# Altium schematic sheet 09_FPGA_misc.SchDoc: FPGA misc
size A3; Organization: Lime Microsystems; Address1: Surrey Tech Centre; Address2: Guildford GU2 7YG; Address3: Surrey; Address4: United Kingdom; Revision: SoDeRa-PCI v1.0; SheetNumber: 9; SheetTotal: 15
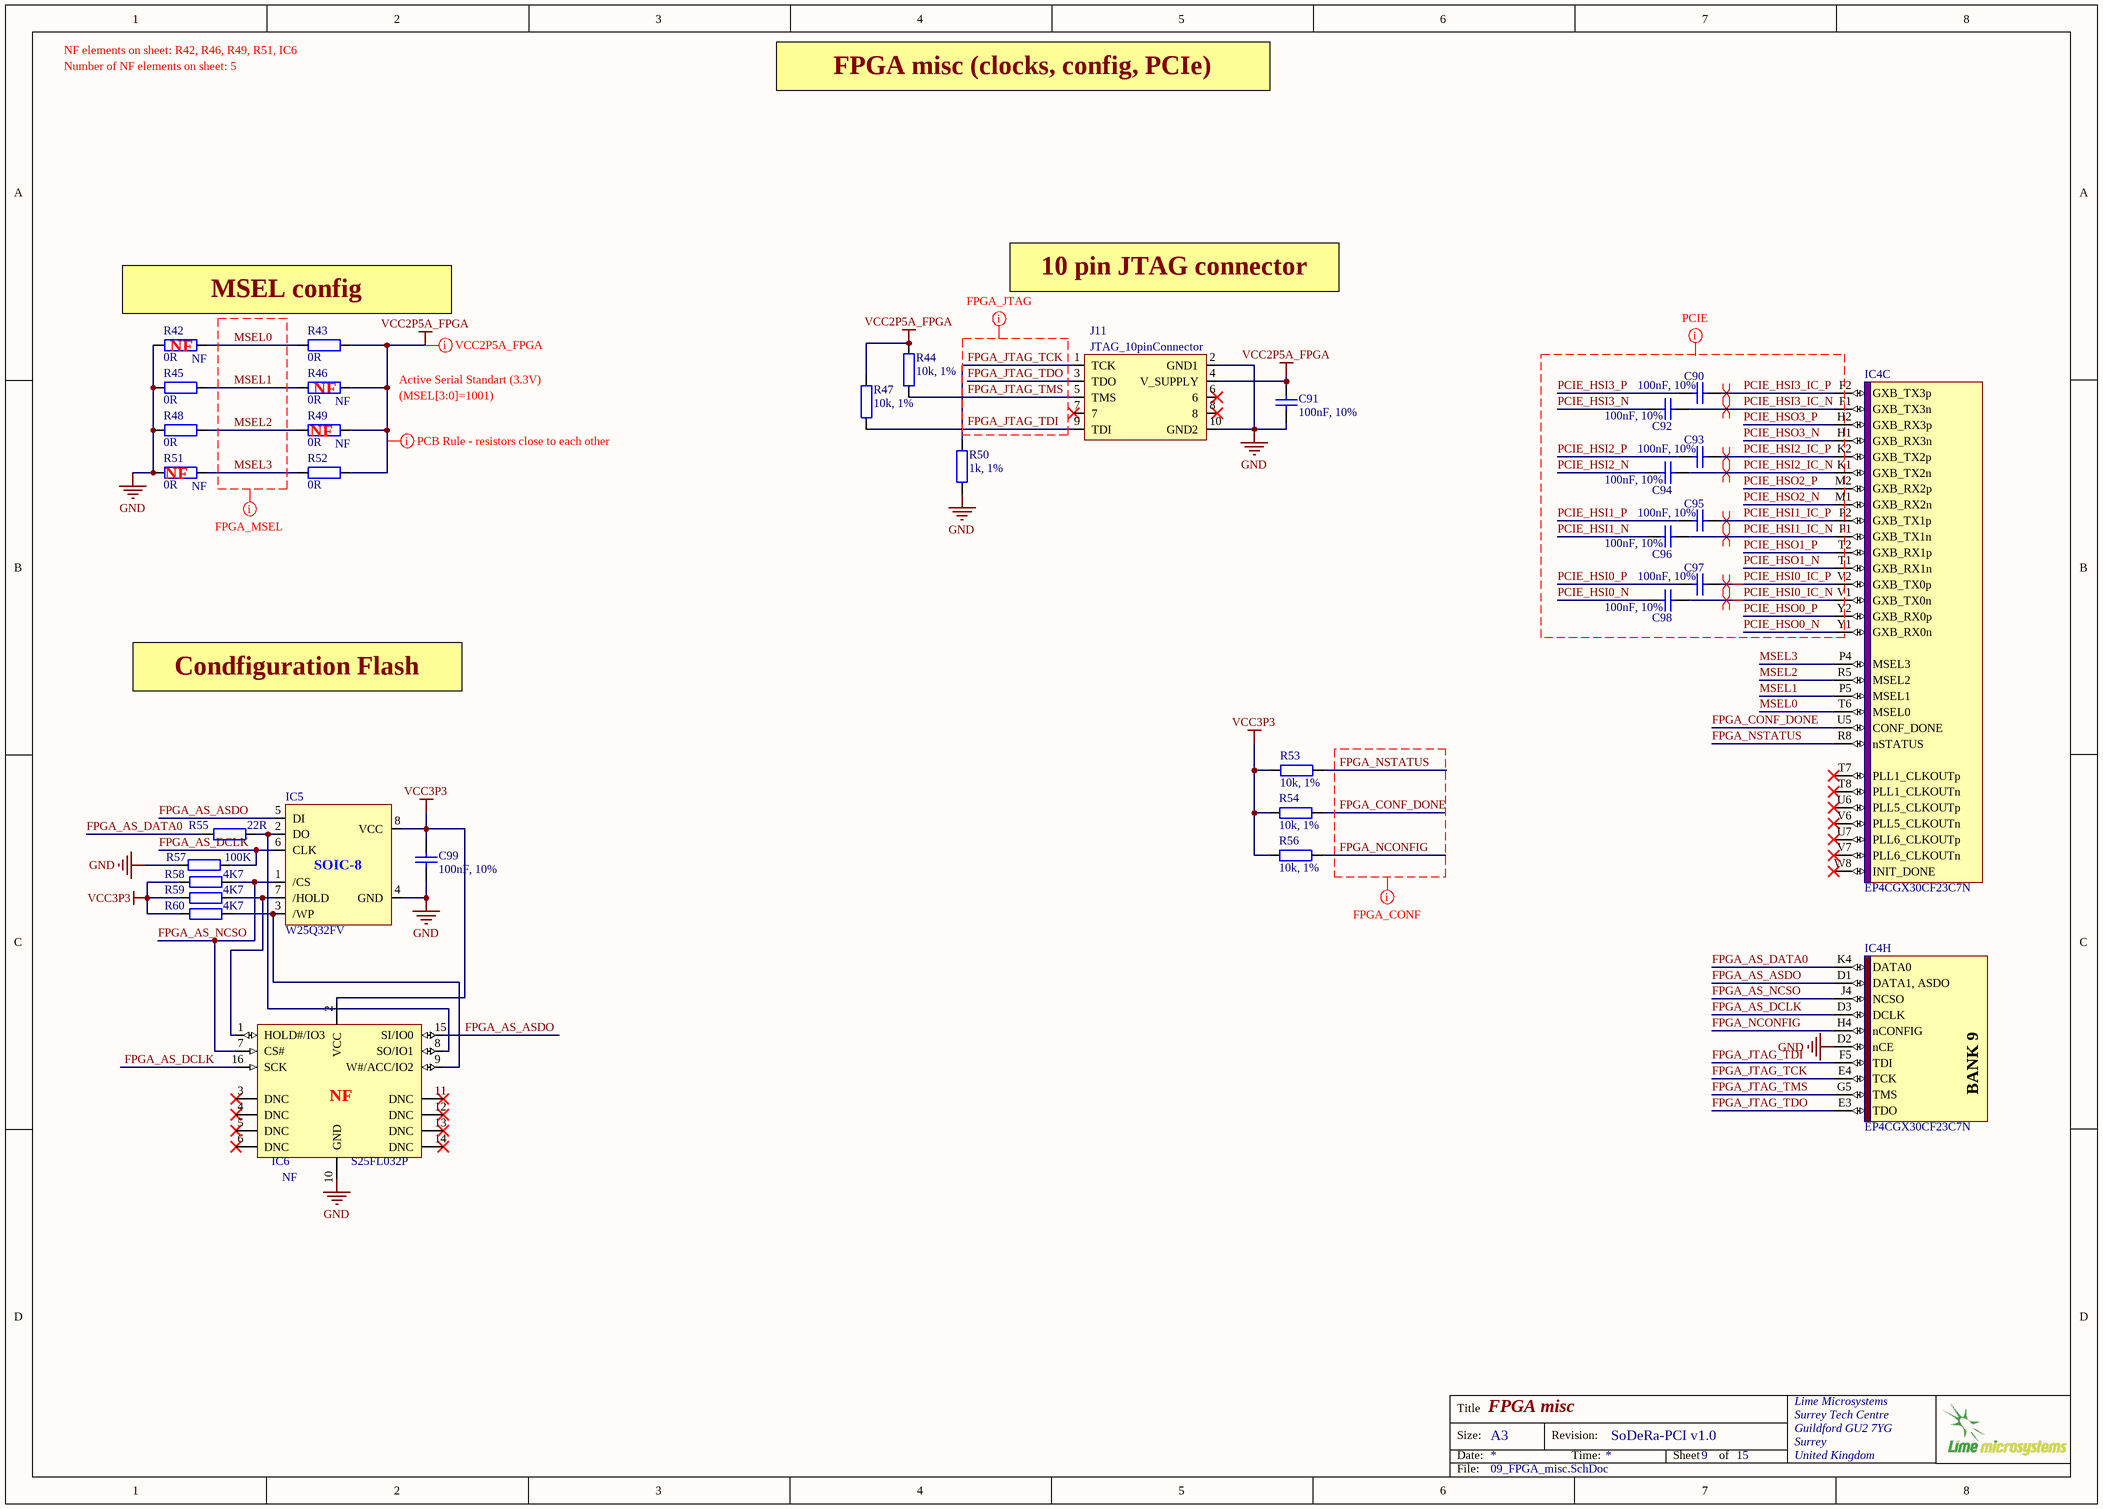
[diagram p0: 09_FPGA_misc.SchDoc]

## Parts
C90  100nF, 10%  [CAP0402]
C91  100nF, 10%  [CAP0402]
C92  100nF, 10%  [CAP0402]
C93  100nF, 10%  [CAP0402]
C94  100nF, 10%  [CAP0402]
C95  100nF, 10%  [CAP0402]
C96  100nF, 10%  [CAP0402]
C97  100nF, 10%  [CAP0402]
C98  100nF, 10%  [CAP0402]
C99  100nF, 10%  [CAP0402]
IC4  EP4CGX30CF23C7N  [ALTR-FBGA484_A-200]  (parts C,H of 10)
IC5  W25Q32FV  [SOIC127P600-8DL_v3]
IC6  S25FL032P  Assembly Info: NF  [SOIC16_WIDE]
J11  JTAG_10pinConnector  [HEADER5x2_SM]
R42  0R  Assembly Info: NF  [RES0402]
R43  0R  [RES0402]
R44  10k, 1%  [RES0402]
R45  0R  [RES0402]
R46  0R  Assembly Info: NF  [RES0402]
R47  10k, 1%  [RES0402]
R48  0R  [RES0402]
R49  0R  Assembly Info: NF  [RES0402]
R50  1k, 1%  [RES0402]
R51  0R  Assembly Info: NF  [RES0402]
R52  0R  [RES0402]
R53  10k, 1%  [RES0402]
R54  10k, 1%  [RES0402]
R55  22R  [RES0402]
R56  10k, 1%  [RES0402]
R57  100K  [RES0402]
R58  4K7  [RES0402]
R59  4K7  [RES0402]
R60  4K7  [RES0402]

## Nets
GND: C91.2 C99.2 IC4.D2(nCE) IC5.4(GND) IC6.10(GND) J11.2(GND1) J11.10(GND2) R42.2 R45.2 R48.2 R50.2 R51.2 R57.2
VCC2P5A_FPGA: C91.1 J11.4(V_SUPPLY) R43.1 R44.1 R46.1 R47.1 R49.1 R52.1
VCC3P3: C99.1 IC5.8(VCC) IC6.2(VCC) R53.1 R54.1 R56.1 R58.1 R59.1 R60.1
FPGA_AS_ASDO: IC4.D1(DATA1,_ASDO) IC5.5(DI) IC6.15(SI/IO0)
FPGA_AS_DATA0: IC4.K4(DATA0) R55.2
FPGA_AS_DCLK: IC4.D3(DCLK) IC5.6(CLK) IC6.16(SCK) R57.1
FPGA_AS_NCSO: IC4.J4(NCSO) IC5.1(/CS) IC6.7(CS#) R58.2
FPGA_CONF_DONE: IC4.U5(CONF_DONE) R54.2
FPGA_JTAG_TCK: IC4.E4(TCK) J11.1(TCK) R50.1
FPGA_JTAG_TDI: IC4.F5(TDI) J11.9(TDI) R47.2
FPGA_JTAG_TDO: IC4.E3(TDO) J11.3(TDO)
FPGA_JTAG_TMS: IC4.G5(TMS) J11.5(TMS) R44.2
FPGA_NCONFIG: IC4.H4(nCONFIG) R56.2
FPGA_NSTATUS: IC4.R8(nSTATUS) R53.2
MSEL0: IC4.T6(MSEL0) R42.1 R43.2
MSEL1: IC4.P5(MSEL1) R45.1 R46.2
MSEL2: IC4.R5(MSEL2) R48.1 R49.2
MSEL3: IC4.P4(MSEL3) R51.1 R52.2
PCIE_HSI0_IC_N: C98.1 IC4.V1(GXB_TX0n)
PCIE_HSI0_IC_P: C97.1 IC4.V2(GXB_TX0p)
PCIE_HSI0_N: C98.2
PCIE_HSI0_P: C97.2
PCIE_HSI1_IC_N: C96.1 IC4.P1(GXB_TX1n)
PCIE_HSI1_IC_P: C95.1 IC4.P2(GXB_TX1p)
PCIE_HSI1_N: C96.2
PCIE_HSI1_P: C95.2
PCIE_HSI2_IC_N: C94.1 IC4.K1(GXB_TX2n)
PCIE_HSI2_IC_P: C93.1 IC4.K2(GXB_TX2p)
PCIE_HSI2_N: C94.2
PCIE_HSI2_P: C93.2
PCIE_HSI3_IC_N: C92.1 IC4.F1(GXB_TX3n)
PCIE_HSI3_IC_P: C90.1 IC4.F2(GXB_TX3p)
PCIE_HSI3_N: C92.2
PCIE_HSI3_P: C90.2
PCIE_HSO0_N: IC4.Y1(GXB_RX0n)
PCIE_HSO0_P: IC4.Y2(GXB_RX0p)
PCIE_HSO1_N: IC4.T1(GXB_RX1n)
PCIE_HSO1_P: IC4.T2(GXB_RX1p)
PCIE_HSO2_N: IC4.M1(GXB_RX2n)
PCIE_HSO2_P: IC4.M2(GXB_RX2p)
PCIE_HSO3_N: IC4.H1(GXB_RX3n)
PCIE_HSO3_P: IC4.H2(GXB_RX3p)
NetIC5_2: IC5.2(DO) IC6.8(SO/IO1) R55.1
NetIC5_3: IC5.3(/WP) IC6.9(W#/ACC/IO2) R60.2
NetIC5_7: IC5.7(/HOLD) IC6.1(HOLD#/IO3) R59.2

Not connected (* = marked no-connect by the designer): IC4 T7(PLL1_CLKOUTp)* T8(PLL1_CLKOUTn)* U6(PLL5_CLKOUTp)* U7(PLL6_CLKOUTp)* V6(PLL5_CLKOUTn)* V7(PLL6_CLKOUTn)* W8(INIT_DONE)*; IC6 3(DNC)* 4(DNC)* 5(DNC)* 6(DNC)* 11(DNC)* 12(DNC)* 13(DNC)* 14(DNC)*; J11 6* 7* 8*

## Layout directives
net class FPGA_JTAG: FPGA_JTAG_TCK, FPGA_JTAG_TDI, FPGA_JTAG_TDO, FPGA_JTAG_TMS
net class FPGA_CONF: FPGA_CONF_DONE, FPGA_NCONFIG, FPGA_NSTATUS
rule Undefined: VCC2P5A_FPGA
net class FPGA_MSEL: MSEL0, MSEL1, MSEL2, MSEL3
differential pair: PCIE_HSI0_IC_N, PCIE_HSI0_IC_P, PCIE_HSI1_IC_N, PCIE_HSI1_IC_P, PCIE_HSI2_IC_N, PCIE_HSI2_IC_P, PCIE_HSI3_IC_N, PCIE_HSI3_IC_P
net class PCIE: PCIE_HSI0_IC_N, PCIE_HSI0_IC_P, PCIE_HSI0_N, PCIE_HSI0_P, PCIE_HSI1_IC_N, PCIE_HSI1_IC_P, PCIE_HSI1_N, PCIE_HSI1_P, PCIE_HSI2_IC_N, PCIE_HSI2_IC_P, PCIE_HSI2_N, PCIE_HSI2_P, PCIE_HSI3_IC_N, PCIE_HSI3_IC_P, PCIE_HSI3_N, PCIE_HSI3_P, PCIE_HSO0_N, PCIE_HSO0_P, PCIE_HSO1_N, PCIE_HSO1_P, PCIE_HSO2_N, PCIE_HSO2_P, PCIE_HSO3_N, PCIE_HSO3_P
net class VCC2P5A_FPGA: VCC2P5A_FPGA

## Notes on the sheet
- NF elements on sheet: R42, R46, R49, R51, IC6
- Number of NF elements on sheet: 5
- FPGA misc (clocks, config, PCIe)
- MSEL config
- 10 pin JTAG connector
- (near R42) NF
- Active Serial Standart (3.3V)
- (near R49) NF
- (near R46) NF
- (MSEL[3:0]=1001)
- (near R51) NF
- Condfiguration Flash
- (near IC6) NF
- Title
- Size:
- Date:
- A3
- Revision:
- Time:
- Sheet
- of
- File:
- (in symbol EP4CGX30CF23C7N, part H) BANK 9
- (in symbol W25Q32FV) SOIC-8

## Library data of the parts
C90-C98 = Cap_0603: Manufacturer: Murata; Brand: Murata Electronics; Type: General Purpose MLCC; Capacitance: 0.1 uF; Temperature Coefficient / Code: +/- 15 %; Voltage Rating DC: 16 V; Supplier 1: Mouser; Supplier Part Number 1: 81-GRM155R71C104KA88; Tolerance: 10 %; Case Code - in: 0402; Category: Multilayer Ceramic Capacitors MLCC - SMD/SMT; Value: 100nF, 10%
C99 = Cap_0603: Manufacturer: Murata; Manufacturer Part Number 1: GRM155R71C104KA88D; Brand: Murata Electronics; Type: General Purpose MLCC; Capacitance: 0.1 uF; Temperature Coefficient / Code: +/- 15 %; Voltage Rating DC: 16 V; Supplier 1: Mouser; Supplier Part Number 1: 81-GRM155R71C104KA88; Tolerance: 10 %; Case Code - in: 0402; Category: Multilayer Ceramic Capacitors MLCC - SMD/SMT; Value: 100nF, 10%; Manufacturer Part Number: GRM155R71C104KA88D
IC4 = EP4CGX30CF23C7N: Manufacturer: Altera; Voltage - Supply: 1.16 V ~ 1.24 V; Number of I/O: 290; Total RAM Bits: 1105920; Number of Logic Elements/Cells: 29440; Number of LABs/CLBs: 1840; Supplier 1: Digi-Key; Package / Case: 484-BGA; Operating Temperature: 0°C ~ 85°C; Mounting Type: Surface Mount; Number of Gates: -; Supplier Device Package: 484-FBGA (23x23); Category: Integrated Circuits (ICs); RoHS: RoHS Compliant; Supplier Part Number 1: 544-2730-ND; Manufacturer Part Number 1: EP4CGX30CF23C7N
IC5 = W25Q32FV: Manufacturer: Winbond Electronics; Manufacturer Part Number 1: W25Q32FVSSIG; Voltage - Supply: 2.7 V ~ 3.6 V; Interface: SPI Serial; Memory Type: FLASH; Speed: 104MHz; Memory Size: 32M (4M x 8); Supplier 1: Digi-Key; Package / Case: 8-SOIC (0.209", 5.30mm Width); RoHS: RoHS Compliant; Packaging: Tube; Format - Memory: FLASH; Supplier Device Package: 8-SOIC; Operating Temperature: -40°C ~ 85°C; Category: Integrated Circuits (ICs); Supplier Part Number 1: W25Q32FVSSIG-ND
IC6 = S25FL032P: Manufacturer Part Number 1: S25FL032P0XMFI001; Manufacturer: Spansion; Speed: 104MHz; Interface: SPI Serial; Memory Size: 32M (4M x 8); Format - Memory: FLASH; Memory Type: FLASH - NOR; Voltage - Supply: 2.7 V ~ 3.6 V; Package / Case: 16-SOIC (0.295", 7.50mm Width); Supplier Device Package: 16-SOIC; Operating Temperature: -40°C ~ 85°C; RoHS: RoHS Compliant; Category: Integrated Circuits (ICs); Packaging: Tube; Supplier 1: Digi-Key; Supplier Part Number 1: S25FL032P0XMFI001-ND
J11 = JTAG_connector_10pin: Manufacturer Part Number 1: 54202-G0805LF; Connector Type: Header, Unshrouded; Number of Positions: 10; Number of Positions Loaded: All; Supplier 1: Digi-Key; Supplier Part Number 1: 609-4723-ND; Contact Type: Male Pin; Category: Connectors, Interconnects; Contact Finish: Gold or Gold, GXT™; Color: Black; Number of Rows: 2; Mounting Type: Surface Mount
R42 R43 R45 R46 R48 R49 R51 R52 = Res_0402: Manufacturer: Yageo; Supplier 1: Digi-Key; Supplier Part Number 1: 311-0.0JRTR-ND; Composition: Thick Film; Package / Case: 0402 (1005 Metric); Category: Resistors; Value: 0R
R44 R47 R53 R54 R56 = Res_0402: Manufacturer: Yageo; Manufacturer Part Number 1: RC0402FR-0710KL; Temperature Coefficient: ±100ppm/°C; Power (Watts): 0.063W, 1/16W; Value: 10k, 1%; Supplier 1: Digi-Key; Supplier Part Number 1: 311-10.0KLRTR-ND; Resistance (Ohms): 10k; Packaging: Tape & Reel (TR); RoHS: RoHS Compliant; Package / Case: 0402 (1005 Metric); Tolerance: ±1%; Operating Temperature: -55°C ~ 155°C; Size / Dimension: 0.039" L x 0.020" W (1.00mm x 0.50mm); Number of Terminations: 2; Category: Resistors; Height: 0.016" (0.40mm); Supplier Device Package: 0402; Features: Moisture Resistant; Composition: Thick Film
R50 = Res_0402: Manufacturer: Stackpole Electronics Inc; Manufacturer Part Number 1: RMCF0402FT1K00; Temperature Coefficient: ±100ppm/°C; Power (Watts): 0.063W, 1/16W; Value: 1k, 1%; Supplier 1: Digi-Key; Supplier Part Number 1: RMCF0402FT1K00TR-ND; Package / Case: 0402 (1005 Metric); Supplier Device Package: 0402; Height: 0.016" (0.40mm); Size / Dimension: 0.039" L x 0.020" W (1.00mm x 0.50mm); Number of Terminations: 2; Packaging: Cut Tape (CT); Category: Resistors; Composition: Thick Film; Resistance (Ohms): 1k; Tolerance: ±1%; Features: Moisture Resistant; Operating Temperature: -55°C ~ 155°C; RoHS: RoHS Compliant
R55 = Res_0402: Tolerance: ±1%; Temperature Coefficient: ±100ppm/°C; Resistance (Ohms): 22; Supplier 1: Digi-Key; Supplier Part Number 1: 311-22.0LRTR-ND; Supplier Device Package: 0402; Composition: Thick Film; Category: Resistors; Value: 22R
R57 = Res_0402: Manufacturer Part Number 1: ERJ-2GEJ104X; Manufacturer: Panasonic Electronic Components; Tolerance: ±5%; Temperature Coefficient: ±200ppm/°C; Power (Watts): 0.1W, 1/10W; Supplier 1: Digi-Key; Supplier Part Number 1: P100KJCT-ND; Resistance (Ohms): 100k; Composition: Thick Film; Features: Automotive AEC-Q200; Number of Terminations: 2; Height: 0.016" (0.40mm); RoHS: RoHS Compliant; Package / Case: 0402 (1005 Metric); Packaging: Cut Tape (CT); Size / Dimension: 0.039" L x 0.020" W (1.00mm x 0.50mm); Supplier Device Package: 0402; Operating Temperature: -55°C ~ 155°C; Category: Resistors; value: 100K
R58-R60 = Res_0402: Manufacturer Part Number 1: RMCF0402JT4K70; Temperature Coefficient: ±100ppm/°C; Resistance(Ohms): 4.7k; Tolerance: ±5%; Supplier 1: Digi-Key; Composition: Thick Film; Supplier Device Package: 0402; Supplier: Digi-Key; Supplier Part Number 1: RMCF0402JT4K70TR-ND; Category: Resistors; Value: 4K7